# Altium schematic sheet 12.RK3588_MIPI_CSI_HDMI2.1_HDMI.SchDoc
size A3; SheetNumber: 12; SheetTotal: 21
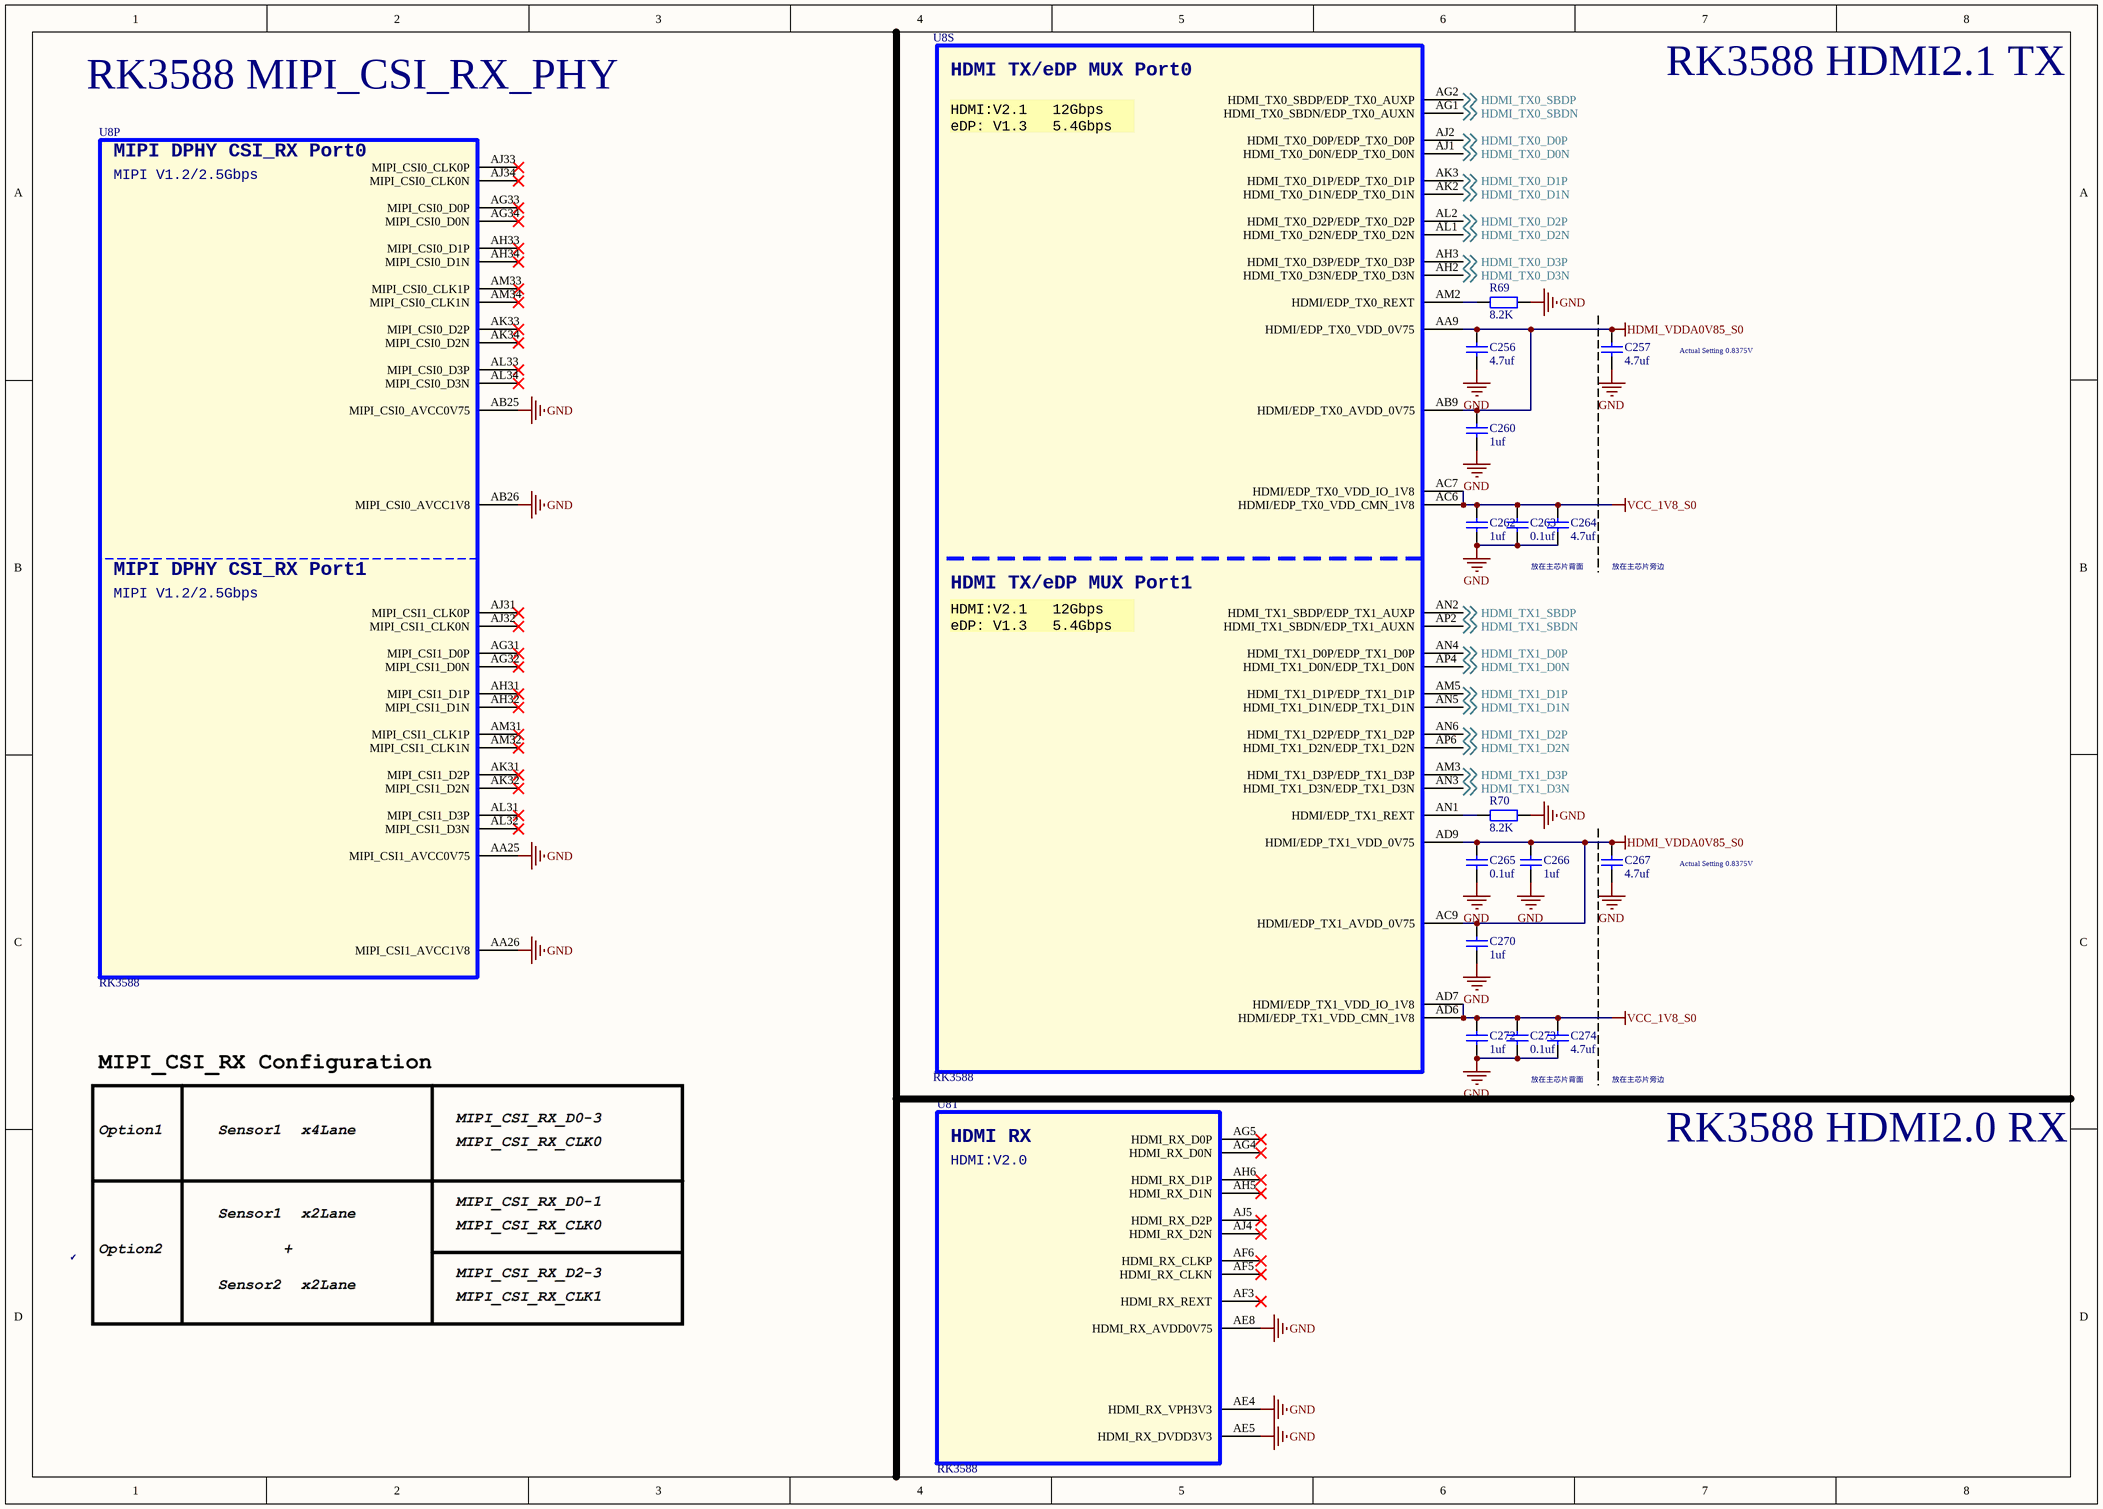
[diagram p0: 12.RK3588_MIPI_CSI_HDMI2.1_HDMI.SchDoc]

## Parts
C256  4.7uf  [C0402_L]
C257  4.7uf  [C0402_L]
C260  1uf  [C0201_L]
C262  1uf  [C0201_L]
C263  0.1uf  [C0201_L]
C264  4.7uf  [C0201_L]
C265  0.1uf  [C0201_L]
C266  1uf  [C0201_L]
C267  4.7uf  [C0402_L]
C270  1uf  [C0201_L]
C272  1uf  [C0201_L]
C273  0.1uf  [C0201_L]
C274  4.7uf  [C0402_L]
R69  8.2K  [R0201_L]
R70  8.2K  [R0201_L]
U8  RK3588  [BGA1088_23R00X23R00X2R00]  (parts P,S,T of 26)

## Nets
GND: C256.1 C257.1 C260.1 C262.1 C263.1 C264.1 C265.1 C266.1 C267.1 C270.1 C272.1 C273.1 C274.1 R69.2 R70.2 U8.AA25(MIPI_CSI1_AVCC0V75) U8.AA26(MIPI_CSI1_AVCC1V8) U8.AB25(MIPI_CSI0_AVCC0V75) U8.AB26(MIPI_CSI0_AVCC1V8) U8.AE4(HDMI_RX_VPH3V3) U8.AE5(HDMI_RX_DVDD3V3) U8.AE8(HDMI_RX_AVDD0V75)
HDMI_VDDA0V85_S0: C256.2 C257.2 C260.2 C265.2 C266.2 C267.2 C270.2 U8.AA9(HDMI/EDP_TX0_VDD_0V75) U8.AB9(HDMI/EDP_TX0_AVDD_0V75) U8.AC9(HDMI/EDP_TX1_AVDD_0V75) U8.AD9(HDMI/EDP_TX1_VDD_0V75)
VCC_1V8_S0: C262.2 C263.2 C264.2 C272.2 C273.2 C274.2 U8.AC6(HDMI/EDP_TX0_VDD_CMN_1V8) U8.AC7(HDMI/EDP_TX0_VDD_IO_1V8) U8.AD6(HDMI/EDP_TX1_VDD_CMN_1V8) U8.AD7(HDMI/EDP_TX1_VDD_IO_1V8)
HDMI_TX0_D0N: U8.AJ1(HDMI_TX0_D0N/EDP_TX0_D0N) ; off-sheet HDMI_TX0_D0N
HDMI_TX0_D0P: U8.AJ2(HDMI_TX0_D0P/EDP_TX0_D0P) ; off-sheet HDMI_TX0_D0P
HDMI_TX0_D1N: U8.AK2(HDMI_TX0_D1N/EDP_TX0_D1N) ; off-sheet HDMI_TX0_D1N
HDMI_TX0_D1P: U8.AK3(HDMI_TX0_D1P/EDP_TX0_D1P) ; off-sheet HDMI_TX0_D1P
HDMI_TX0_D2N: U8.AL1(HDMI_TX0_D2N/EDP_TX0_D2N) ; off-sheet HDMI_TX0_D2N
HDMI_TX0_D2P: U8.AL2(HDMI_TX0_D2P/EDP_TX0_D2P) ; off-sheet HDMI_TX0_D2P
HDMI_TX0_D3N: U8.AH2(HDMI_TX0_D3N/EDP_TX0_D3N) ; off-sheet HDMI_TX0_D3N
HDMI_TX0_D3P: U8.AH3(HDMI_TX0_D3P/EDP_TX0_D3P) ; off-sheet HDMI_TX0_D3P
HDMI_TX0_SBDN: U8.AG1(HDMI_TX0_SBDN/EDP_TX0_AUXN) ; off-sheet HDMI_TX0_SBDN
HDMI_TX0_SBDP: U8.AG2(HDMI_TX0_SBDP/EDP_TX0_AUXP) ; off-sheet HDMI_TX0_SBDP
HDMI_TX1_D0N: U8.AP4(HDMI_TX1_D0N/EDP_TX1_D0N) ; off-sheet HDMI_TX1_D0N
HDMI_TX1_D0P: U8.AN4(HDMI_TX1_D0P/EDP_TX1_D0P) ; off-sheet HDMI_TX1_D0P
HDMI_TX1_D1N: U8.AN5(HDMI_TX1_D1N/EDP_TX1_D1N) ; off-sheet HDMI_TX1_D1N
HDMI_TX1_D1P: U8.AM5(HDMI_TX1_D1P/EDP_TX1_D1P) ; off-sheet HDMI_TX1_D1P
HDMI_TX1_D2N: U8.AP6(HDMI_TX1_D2N/EDP_TX1_D2N) ; off-sheet HDMI_TX1_D2N
HDMI_TX1_D2P: U8.AN6(HDMI_TX1_D2P/EDP_TX1_D2P) ; off-sheet HDMI_TX1_D2P
HDMI_TX1_D3N: U8.AN3(HDMI_TX1_D3N/EDP_TX1_D3N) ; off-sheet HDMI_TX1_D3N
HDMI_TX1_D3P: U8.AM3(HDMI_TX1_D3P/EDP_TX1_D3P) ; off-sheet HDMI_TX1_D3P
HDMI_TX1_SBDN: U8.AP2(HDMI_TX1_SBDN/EDP_TX1_AUXN) ; off-sheet HDMI_TX1_SBDN
HDMI_TX1_SBDP: U8.AN2(HDMI_TX1_SBDP/EDP_TX1_AUXP) ; off-sheet HDMI_TX1_SBDP
NetR69_1: R69.1 U8.AM2(HDMI/EDP_TX0_REXT)
NetR70_1: R70.1 U8.AN1(HDMI/EDP_TX1_REXT)

Not connected (* = marked no-connect by the designer): U8 AF3(HDMI_RX_REXT)* AF5(HDMI_RX_CLKN)* AF6(HDMI_RX_CLKP)* AG4(HDMI_RX_D0N)* AG5(HDMI_RX_D0P)* AG31(MIPI_CSI1_D0P)* AG32(MIPI_CSI1_D0N)* AG33(MIPI_CSI0_D0P)* AG34(MIPI_CSI0_D0N)* AH5(HDMI_RX_D1N)* AH6(HDMI_RX_D1P)* AH31(MIPI_CSI1_D1P)* AH32(MIPI_CSI1_D1N)* AH33(MIPI_CSI0_D1P)* AH34(MIPI_CSI0_D1N)* AJ4(HDMI_RX_D2N)* AJ5(HDMI_RX_D2P)* AJ31(MIPI_CSI1_CLK0P)* AJ32(MIPI_CSI1_CLK0N)* AJ33(MIPI_CSI0_CLK0P)* AJ34(MIPI_CSI0_CLK0N)* AK31(MIPI_CSI1_D2P)* AK32(MIPI_CSI1_D2N)* AK33(MIPI_CSI0_D2P)* AK34(MIPI_CSI0_D2N)* AL31(MIPI_CSI1_D3P)* AL32(MIPI_CSI1_D3N)* AL33(MIPI_CSI0_D3P)* AL34(MIPI_CSI0_D3N)* AM31(MIPI_CSI1_CLK1P)* AM32(MIPI_CSI1_CLK1N)* AM33(MIPI_CSI0_CLK1P)* AM34(MIPI_CSI0_CLK1N)*

## Notes on the sheet
- RK3588 MIPI_CSI_RX_PHY
- RK3588 HDMI2.1 TX
- Actual Setting 0.8375V
- 放在主芯片背面
- 放在主芯片旁边
- RK3588 HDMI2.0 RX
- ✔
- (in symbol SOC_RK3588, part P) MIPI DPHY CSI_RX Port0; MIPI V1.2/2.5Gbps; MIPI DPHY CSI_RX Port1
- (in symbol SOC_RK3588, part S) HDMI TX/eDP MUX Port0; HDMI:V2.1   12Gbps / eDP: V1.3   5.4Gbps; HDMI TX/eDP MUX Port1
- (in symbol SOC_RK3588, part T) HDMI RX; HDMI:V2.0

## Library data of the parts
C256 C257 C260 C262-C267 C270 C272-C274 = C: 贴片电容/MLCC电容
R69 R70 = R: 贴片电阻
U8 = SOC_RK3588: ROCKCHIP SOC